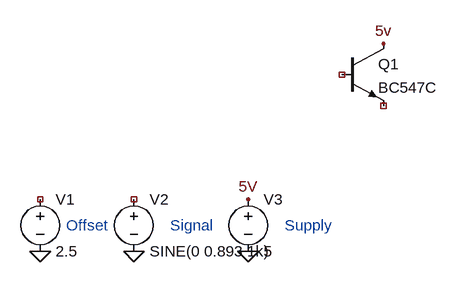
[diagram p0: schematic aux_preamp-Fred.asc]
aux_preamp-Fred.asc, the LTspice schematic file:
Version 4
SHEET 1 880 680
FLAG -336 432 0
FLAG -192 432 0
FLAG -16 432 0
FLAG -16 352 5V
FLAG 192 112 5v
SYMBOL npn 128 112 R0
SYMATTR InstName Q1
SYMATTR Value BC547C
SYMBOL voltage -336 336 R0
WINDOW 123 0 0 Left 0
WINDOW 39 0 0 Left 0
SYMATTR InstName V1
SYMATTR Value 2.5
SYMBOL voltage -192 336 R0
WINDOW 123 0 0 Left 0
WINDOW 39 0 0 Left 0
SYMATTR InstName V2
SYMATTR Value SINE(0 0.893 1k)
SYMBOL voltage -16 336 R0
WINDOW 123 0 0 Left 0
WINDOW 39 0 0 Left 0
SYMATTR InstName V3
SYMATTR Value 5
TEXT -136 392 Left 2 ;Signal
TEXT -296 392 Left 2 ;Offset
TEXT 40 392 Left 2 ;Supply

The netlist it stands for:
* aux_preamp-Fred.asc
Q1 5V NC_01 NC_02 0 BC547C
V1 NC_03 0 2.5
V2 NC_04 0 SINE(0 0.893 1k)
V3 5V 0 5
.model NPN NPN
.model PNP PNP
.lib standard.bjt
* Signal
* Offset
* Supply
.backanno
.end